# Altium schematic sheet Cell.SchDoc
size 152 x 88 mm
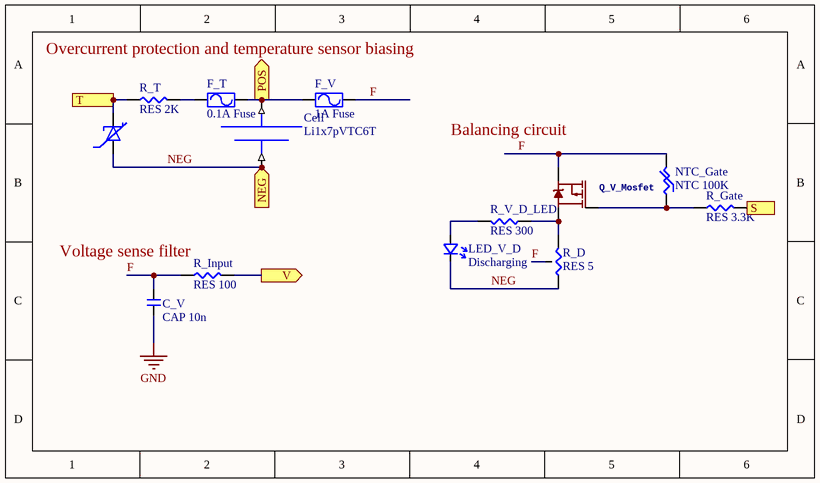
[diagram p0: Cell.SchDoc]

## Parts
C_V  CAP 10n  [CAP-0603]
Cell  Li1x7pVTC6T  [Li1x7pVTC6T]
F_T  0.1A Fuse  [2410SMD]
F_V  1A Fuse  [2410SMD]
LED_V_D  Discharging  [LED-0603]
NTC_Gate  NTC 100K  [NTC-0603]
Q_V_Mosfet  (no value)  [TO252]
R_D  RES 5  [TO252-TKH-45]
R_Gate  RES 3.3K  [RES-0603]
R_Input  RES 100  [RES-0603]
R_T  RES 2K  [RES-0603]
R_V_D_LED  RES 300  [RES-0603]

## Ports
NEG (in), POS (out), S (in), T (out), V (out)

## Nets
GND: C_V.1
F: C_V.2 F_V.1 NTC_Gate.2 Q_V_Mosfet.3(S) R_D.3 R_Input.1
NEG: Cell.- Cell.T- LED_V_D.K R_D.1 ; port NEG
POS: Cell.+ F_T.1 F_V.2 ; port POS
S: R_Gate.2 ; port S
T: Cell.T+ R_T.1 ; port T
V: R_Input.2 ; port V
NetF_T_2: F_T.2 R_T.2
NetLED_V_D_A: LED_V_D.A R_V_D_LED.2
NetNTC_Gate_1: NTC_Gate.1 Q_V_Mosfet.1(G) R_Gate.1
NetQ_V_Mosfet_2: Q_V_Mosfet.2(D) R_D.2 R_V_D_LED.1

## Notes on the sheet
- Overcurrent protection and temperature sensor biasing
- (near Q_V_Mosfet) Balancing circuit
- (near R_Input) Voltage sense filter

## Library data of the parts
C_V = CAP-0603
F_T F_V = 0679L
LED_V_D = LED-0603
NTC_Gate = NTC-0603
Q_V_Mosfet = DMP10H400SK3-13: GateName_1: G$1; SymbolName_1: LABELED-PMOS; LibraryName: IFE_Transistors; DeviceSetName: DMP10H400SK3-13; Package: TO252
R_D = TKH45
R_Gate R_Input R_T R_V_D_LED = RES-0603